# Altium schematic sheet K7410tFFG900HR.SchDoc
size A3
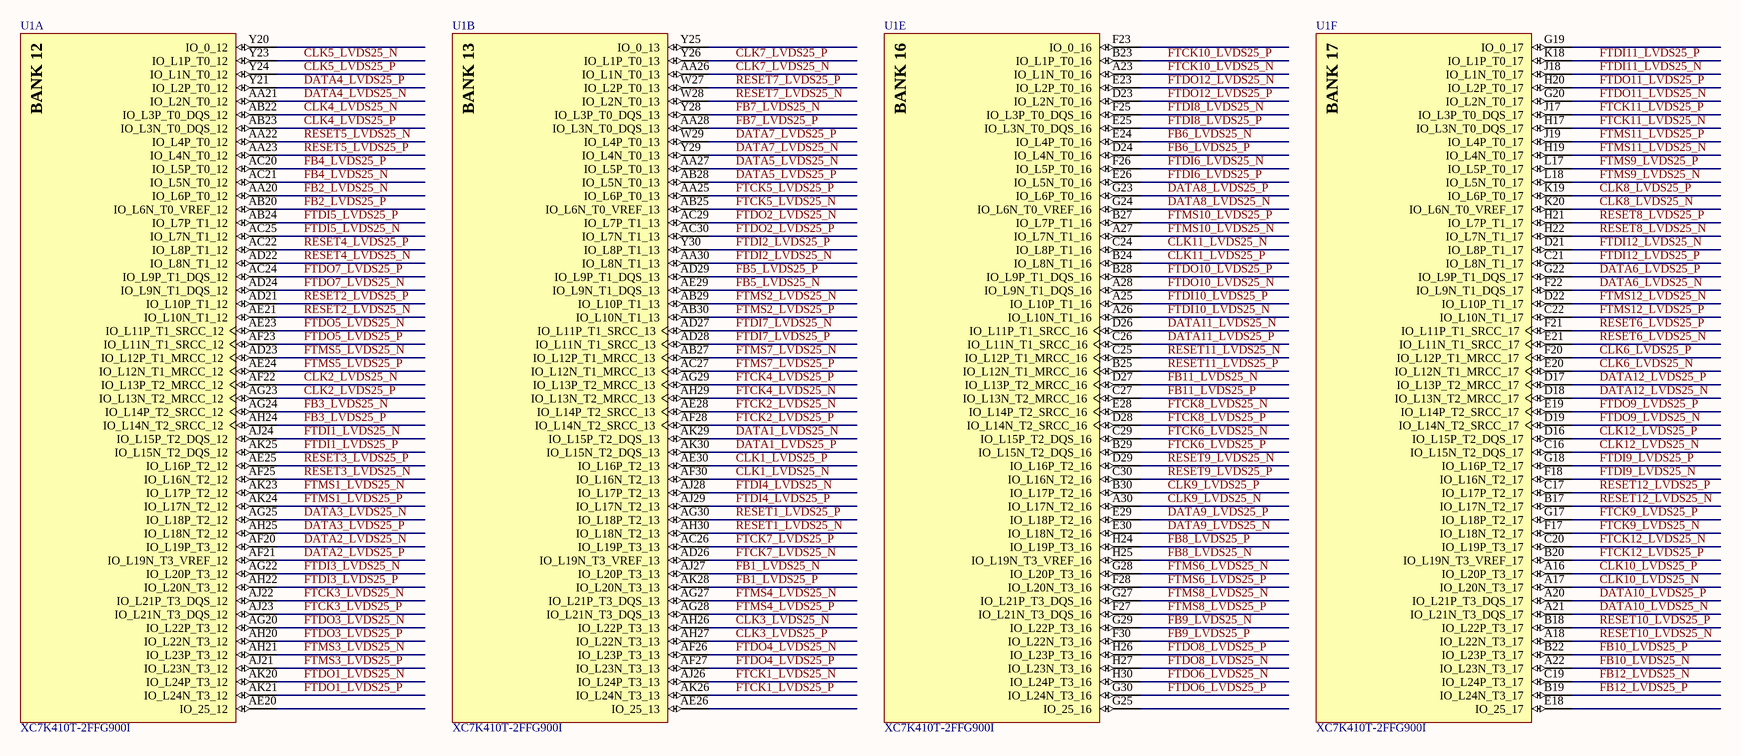
[diagram p0: K7410tFFG900HR.SchDoc]

## Parts
U1  XC7K410T-2FFG900I  [FFG900]  (parts A,B,E,F of 16)

## Nets
CLK1_LVDS25_N: U1.AF30(IO_L16N_T2_13)
CLK1_LVDS25_P: U1.AE30(IO_L16P_T2_13)
CLK2_LVDS25_N: U1.AF22(IO_L13P_T2_MRCC_12)
CLK2_LVDS25_P: U1.AG23(IO_L13N_T2_MRCC_12)
CLK3_LVDS25_N: U1.AH26(IO_L22P_T3_13)
CLK3_LVDS25_P: U1.AH27(IO_L22N_T3_13)
CLK4_LVDS25_N: U1.AB22(IO_L3P_T0_DQS_12)
CLK4_LVDS25_P: U1.AB23(IO_L3N_T0_DQS_12)
CLK5_LVDS25_N: U1.Y23(IO_L1P_T0_12)
CLK5_LVDS25_P: U1.Y24(IO_L1N_T0_12)
CLK6_LVDS25_N: U1.E20(IO_L12N_T1_MRCC_17)
CLK6_LVDS25_P: U1.F20(IO_L12P_T1_MRCC_17)
CLK7_LVDS25_N: U1.AA26(IO_L1N_T0_13)
CLK7_LVDS25_P: U1.Y26(IO_L1P_T0_13)
CLK8_LVDS25_N: U1.K20(IO_L6N_T0_VREF_17)
CLK8_LVDS25_P: U1.K19(IO_L6P_T0_17)
CLK9_LVDS25_N: U1.A30(IO_L17N_T2_16)
CLK9_LVDS25_P: U1.B30(IO_L17P_T2_16)
CLK10_LVDS25_N: U1.A17(IO_L20N_T3_17)
CLK10_LVDS25_P: U1.A16(IO_L20P_T3_17)
CLK11_LVDS25_N: U1.C24(IO_L8P_T1_16)
CLK11_LVDS25_P: U1.B24(IO_L8N_T1_16)
CLK12_LVDS25_N: U1.C16(IO_L15N_T2_DQS_17)
CLK12_LVDS25_P: U1.D16(IO_L15P_T2_DQS_17)
DATA1_LVDS25_N: U1.AK29(IO_L15P_T2_DQS_13)
DATA1_LVDS25_P: U1.AK30(IO_L15N_T2_DQS_13)
DATA2_LVDS25_N: U1.AF20(IO_L19P_T3_12)
DATA2_LVDS25_P: U1.AF21(IO_L19N_T3_VREF_12)
DATA3_LVDS25_N: U1.AG25(IO_L18P_T2_12)
DATA3_LVDS25_P: U1.AH25(IO_L18N_T2_12)
DATA4_LVDS25_N: U1.AA21(IO_L2N_T0_12)
DATA4_LVDS25_P: U1.Y21(IO_L2P_T0_12)
DATA5_LVDS25_N: U1.AA27(IO_L5P_T0_13)
DATA5_LVDS25_P: U1.AB28(IO_L5N_T0_13)
DATA6_LVDS25_N: U1.F22(IO_L9N_T1_DQS_17)
DATA6_LVDS25_P: U1.G22(IO_L9P_T1_DQS_17)
DATA7_LVDS25_N: U1.Y29(IO_L4N_T0_13)
DATA7_LVDS25_P: U1.W29(IO_L4P_T0_13)
DATA8_LVDS25_N: U1.G24(IO_L6N_T0_VREF_16)
DATA8_LVDS25_P: U1.G23(IO_L6P_T0_16)
DATA9_LVDS25_N: U1.E30(IO_L18N_T2_16)
DATA9_LVDS25_P: U1.E29(IO_L18P_T2_16)
DATA10_LVDS25_N: U1.A21(IO_L21N_T3_DQS_17)
DATA10_LVDS25_P: U1.A20(IO_L21P_T3_DQS_17)
DATA11_LVDS25_N: U1.D26(IO_L11P_T1_SRCC_16)
DATA11_LVDS25_P: U1.C26(IO_L11N_T1_SRCC_16)
DATA12_LVDS25_N: U1.D18(IO_L13N_T2_MRCC_17)
DATA12_LVDS25_P: U1.D17(IO_L13P_T2_MRCC_17)
FB1_LVDS25_N: U1.AJ27(IO_L20P_T3_13)
FB1_LVDS25_P: U1.AK28(IO_L20N_T3_13)
FB2_LVDS25_N: U1.AA20(IO_L6P_T0_12)
FB2_LVDS25_P: U1.AB20(IO_L6N_T0_VREF_12)
FB3_LVDS25_N: U1.AG24(IO_L14P_T2_SRCC_12)
FB3_LVDS25_P: U1.AH24(IO_L14N_T2_SRCC_12)
FB4_LVDS25_N: U1.AC21(IO_L5N_T0_12)
FB4_LVDS25_P: U1.AC20(IO_L5P_T0_12)
FB5_LVDS25_N: U1.AE29(IO_L9N_T1_DQS_13)
FB5_LVDS25_P: U1.AD29(IO_L9P_T1_DQS_13)
FB6_LVDS25_N: U1.E24(IO_L4P_T0_16)
FB6_LVDS25_P: U1.D24(IO_L4N_T0_16)
FB7_LVDS25_N: U1.Y28(IO_L3P_T0_DQS_13)
FB7_LVDS25_P: U1.AA28(IO_L3N_T0_DQS_13)
FB8_LVDS25_N: U1.H25(IO_L19N_T3_VREF_16)
FB8_LVDS25_P: U1.H24(IO_L19P_T3_16)
FB9_LVDS25_N: U1.G29(IO_L22P_T3_16)
FB9_LVDS25_P: U1.F30(IO_L22N_T3_16)
FB10_LVDS25_N: U1.A22(IO_L23N_T3_17)
FB10_LVDS25_P: U1.B22(IO_L23P_T3_17)
FB11_LVDS25_N: U1.D27(IO_L13P_T2_MRCC_16)
FB11_LVDS25_P: U1.C27(IO_L13N_T2_MRCC_16)
FB12_LVDS25_N: U1.C19(IO_L24P_T3_17)
FB12_LVDS25_P: U1.B19(IO_L24N_T3_17)
FTCK1_LVDS25_N: U1.AJ26(IO_L24P_T3_13)
FTCK1_LVDS25_P: U1.AK26(IO_L24N_T3_13)
FTCK2_LVDS25_N: U1.AE28(IO_L14P_T2_SRCC_13)
FTCK2_LVDS25_P: U1.AF28(IO_L14N_T2_SRCC_13)
FTCK3_LVDS25_N: U1.AJ22(IO_L21P_T3_DQS_12)
FTCK3_LVDS25_P: U1.AJ23(IO_L21N_T3_DQS_12)
FTCK4_LVDS25_N: U1.AH29(IO_L13N_T2_MRCC_13)
FTCK4_LVDS25_P: U1.AG29(IO_L13P_T2_MRCC_13)
FTCK5_LVDS25_N: U1.AB25(IO_L6N_T0_VREF_13)
FTCK5_LVDS25_P: U1.AA25(IO_L6P_T0_13)
FTCK6_LVDS25_N: U1.C29(IO_L15P_T2_DQS_16)
FTCK6_LVDS25_P: U1.B29(IO_L15N_T2_DQS_16)
FTCK7_LVDS25_N: U1.AD26(IO_L19N_T3_VREF_13)
FTCK7_LVDS25_P: U1.AC26(IO_L19P_T3_13)
FTCK8_LVDS25_N: U1.E28(IO_L14P_T2_SRCC_16)
FTCK8_LVDS25_P: U1.D28(IO_L14N_T2_SRCC_16)
FTCK9_LVDS25_N: U1.F17(IO_L18N_T2_17)
FTCK9_LVDS25_P: U1.G17(IO_L18P_T2_17)
FTCK10_LVDS25_N: U1.A23(IO_L1N_T0_16)
FTCK10_LVDS25_P: U1.B23(IO_L1P_T0_16)
FTCK11_LVDS25_N: U1.H17(IO_L3N_T0_DQS_17)
FTCK11_LVDS25_P: U1.J17(IO_L3P_T0_DQS_17)
FTCK12_LVDS25_N: U1.C20(IO_L19P_T3_17)
FTCK12_LVDS25_P: U1.B20(IO_L19N_T3_VREF_17)
FTDI1_LVDS25_N: U1.AJ24(IO_L15P_T2_DQS_12)
FTDI1_LVDS25_P: U1.AK25(IO_L15N_T2_DQS_12)
FTDI2_LVDS25_N: U1.AA30(IO_L8N_T1_13)
FTDI2_LVDS25_P: U1.Y30(IO_L8P_T1_13)
FTDI3_LVDS25_N: U1.AG22(IO_L20P_T3_12)
FTDI3_LVDS25_P: U1.AH22(IO_L20N_T3_12)
FTDI4_LVDS25_N: U1.AJ28(IO_L17P_T2_13)
FTDI4_LVDS25_P: U1.AJ29(IO_L17N_T2_13)
FTDI5_LVDS25_N: U1.AC25(IO_L7N_T1_12)
FTDI5_LVDS25_P: U1.AB24(IO_L7P_T1_12)
FTDI6_LVDS25_N: U1.F26(IO_L5P_T0_16)
FTDI6_LVDS25_P: U1.E26(IO_L5N_T0_16)
FTDI7_LVDS25_N: U1.AD27(IO_L11P_T1_SRCC_13)
FTDI7_LVDS25_P: U1.AD28(IO_L11N_T1_SRCC_13)
FTDI8_LVDS25_N: U1.F25(IO_L3P_T0_DQS_16)
FTDI8_LVDS25_P: U1.E25(IO_L3N_T0_DQS_16)
FTDI9_LVDS25_N: U1.F18(IO_L16N_T2_17)
FTDI9_LVDS25_P: U1.G18(IO_L16P_T2_17)
FTDI10_LVDS25_N: U1.A26(IO_L10N_T1_16)
FTDI10_LVDS25_P: U1.A25(IO_L10P_T1_16)
FTDI11_LVDS25_N: U1.J18(IO_L1N_T0_17)
FTDI11_LVDS25_P: U1.K18(IO_L1P_T0_17)
FTDI12_LVDS25_N: U1.D21(IO_L8P_T1_17)
FTDI12_LVDS25_P: U1.C21(IO_L8N_T1_17)
FTDO1_LVDS25_N: U1.AK20(IO_L24P_T3_12)
FTDO1_LVDS25_P: U1.AK21(IO_L24N_T3_12)
FTDO2_LVDS25_N: U1.AC29(IO_L7P_T1_13)
FTDO2_LVDS25_P: U1.AC30(IO_L7N_T1_13)
FTDO3_LVDS25_N: U1.AG20(IO_L22P_T3_12)
FTDO3_LVDS25_P: U1.AH20(IO_L22N_T3_12)
FTDO4_LVDS25_N: U1.AF26(IO_L23P_T3_13)
FTDO4_LVDS25_P: U1.AF27(IO_L23N_T3_13)
FTDO5_LVDS25_N: U1.AE23(IO_L11P_T1_SRCC_12)
FTDO5_LVDS25_P: U1.AF23(IO_L11N_T1_SRCC_12)
FTDO6_LVDS25_N: U1.H30(IO_L24P_T3_16)
FTDO6_LVDS25_P: U1.G30(IO_L24N_T3_16)
FTDO7_LVDS25_N: U1.AD24(IO_L9N_T1_DQS_12)
FTDO7_LVDS25_P: U1.AC24(IO_L9P_T1_DQS_12)
FTDO8_LVDS25_N: U1.H27(IO_L23N_T3_16)
FTDO8_LVDS25_P: U1.H26(IO_L23P_T3_16)
FTDO9_LVDS25_N: U1.D19(IO_L14N_T2_SRCC_17)
FTDO9_LVDS25_P: U1.E19(IO_L14P_T2_SRCC_17)
FTDO10_LVDS25_N: U1.A28(IO_L9N_T1_DQS_16)
FTDO10_LVDS25_P: U1.B28(IO_L9P_T1_DQS_16)
FTDO11_LVDS25_N: U1.G20(IO_L2N_T0_17)
FTDO11_LVDS25_P: U1.H20(IO_L2P_T0_17)
FTDO12_LVDS25_N: U1.E23(IO_L2P_T0_16)
FTDO12_LVDS25_P: U1.D23(IO_L2N_T0_16)
FTMS1_LVDS25_N: U1.AK23(IO_L17P_T2_12)
FTMS1_LVDS25_P: U1.AK24(IO_L17N_T2_12)
FTMS2_LVDS25_N: U1.AB29(IO_L10P_T1_13)
FTMS2_LVDS25_P: U1.AB30(IO_L10N_T1_13)
FTMS3_LVDS25_N: U1.AH21(IO_L23P_T3_12)
FTMS3_LVDS25_P: U1.AJ21(IO_L23N_T3_12)
FTMS4_LVDS25_N: U1.AG27(IO_L21P_T3_DQS_13)
FTMS4_LVDS25_P: U1.AG28(IO_L21N_T3_DQS_13)
FTMS5_LVDS25_N: U1.AD23(IO_L12P_T1_MRCC_12)
FTMS5_LVDS25_P: U1.AE24(IO_L12N_T1_MRCC_12)
FTMS6_LVDS25_N: U1.G28(IO_L20P_T3_16)
FTMS6_LVDS25_P: U1.F28(IO_L20N_T3_16)
FTMS7_LVDS25_N: U1.AB27(IO_L12P_T1_MRCC_13)
FTMS7_LVDS25_P: U1.AC27(IO_L12N_T1_MRCC_13)
FTMS8_LVDS25_N: U1.G27(IO_L21P_T3_DQS_16)
FTMS8_LVDS25_P: U1.F27(IO_L21N_T3_DQS_16)
FTMS9_LVDS25_N: U1.L18(IO_L5N_T0_17)
FTMS9_LVDS25_P: U1.L17(IO_L5P_T0_17)
FTMS10_LVDS25_N: U1.A27(IO_L7N_T1_16)
FTMS10_LVDS25_P: U1.B27(IO_L7P_T1_16)
FTMS11_LVDS25_N: U1.H19(IO_L4N_T0_17)
FTMS11_LVDS25_P: U1.J19(IO_L4P_T0_17)
FTMS12_LVDS25_N: U1.D22(IO_L10P_T1_17)
FTMS12_LVDS25_P: U1.C22(IO_L10N_T1_17)
RESET1_LVDS25_N: U1.AH30(IO_L18N_T2_13)
RESET1_LVDS25_P: U1.AG30(IO_L18P_T2_13)
RESET2_LVDS25_N: U1.AE21(IO_L10N_T1_12)
RESET2_LVDS25_P: U1.AD21(IO_L10P_T1_12)
RESET3_LVDS25_N: U1.AF25(IO_L16N_T2_12)
RESET3_LVDS25_P: U1.AE25(IO_L16P_T2_12)
RESET4_LVDS25_N: U1.AD22(IO_L8N_T1_12)
RESET4_LVDS25_P: U1.AC22(IO_L8P_T1_12)
RESET5_LVDS25_N: U1.AA22(IO_L4P_T0_12)
RESET5_LVDS25_P: U1.AA23(IO_L4N_T0_12)
RESET6_LVDS25_N: U1.E21(IO_L11N_T1_SRCC_17)
RESET6_LVDS25_P: U1.F21(IO_L11P_T1_SRCC_17)
RESET7_LVDS25_N: U1.W28(IO_L2N_T0_13)
RESET7_LVDS25_P: U1.W27(IO_L2P_T0_13)
RESET8_LVDS25_N: U1.H22(IO_L7N_T1_17)
RESET8_LVDS25_P: U1.H21(IO_L7P_T1_17)
RESET9_LVDS25_N: U1.D29(IO_L16P_T2_16)
RESET9_LVDS25_P: U1.C30(IO_L16N_T2_16)
RESET10_LVDS25_N: U1.A18(IO_L22N_T3_17)
RESET10_LVDS25_P: U1.B18(IO_L22P_T3_17)
RESET11_LVDS25_N: U1.C25(IO_L12P_T1_MRCC_16)
RESET11_LVDS25_P: U1.B25(IO_L12N_T1_MRCC_16)
RESET12_LVDS25_N: U1.B17(IO_L17N_T2_17)
RESET12_LVDS25_P: U1.C17(IO_L17P_T2_17)

Not connected (* = marked no-connect by the designer): U1 AE20(IO_25_12) AE26(IO_25_13) E18(IO_25_17) F23(IO_0_16) G19(IO_0_17) G25(IO_25_16) Y20(IO_0_12) Y25(IO_0_13)

## Notes on the sheet
- (in symbol XC7K410T-2FFG900I, part A) BANK 12
- (in symbol XC7K410T-2FFG900I, part B) BANK 13
- (in symbol XC7K410T-2FFG900I, part E) BANK 16
- (in symbol XC7K410T-2FFG900I, part F) BANK 17

## Library data of the parts
U1 = XC7K410T-2FFG900I: Kintex-7 FPGA, 500 User I/Os, 16 GTX, 900-Ball BGA, Speed Grade 2, Industrial Grade, Pb-Free; Manufacturer: Xilinx; GTX: 16; SelectIO HP: 150; SelectIO HR: 350; Speed Grade: -2; DatasheetVersion: v1.12; PackageVersion: Rev 1.1; PackageReference: FFG900; PackageDescription: Flip-Chip BGA, Body 31 x 31 mm, 1.0 mm Pitch; Generic Part Number: XC7K410T; RoHS: Pb-Free; Mounting Technology: Surface Mount; Code_JEDEC: MS-034-AAN-1; PartNumber: XC7K410T-2FFG900I; ComponentLink1Description: Datasheet; ComponentLink1URL: http://www.xilinx.com/support/documentation/data_sheets/ds180_7Series_Overview.pdf; ComponentLink2Description: Package Specification; ComponentLink2URL: http://www.xilinx.com/support/documentation/user_guides/ug865-Zynq-7000-Pkg-Pinout.pdf